# Altium schematic sheet Sensors.SchDoc: Sensors
size A4; ApprovedBy: LD Stanton; Author: LD Stanton; CompanyName: University of Cape Town; DrawnBy: Lawrence Stanton; Engineer: Lawrence Stanton; Organization: University of Cape Town; Address1: Department of Electrical Engineering; Address2: Rondebosch; Address3: Cape Town; Address4: South Africa 7701; DocumentNumber: 13; SheetNumber: 13; SheetTotal: 20
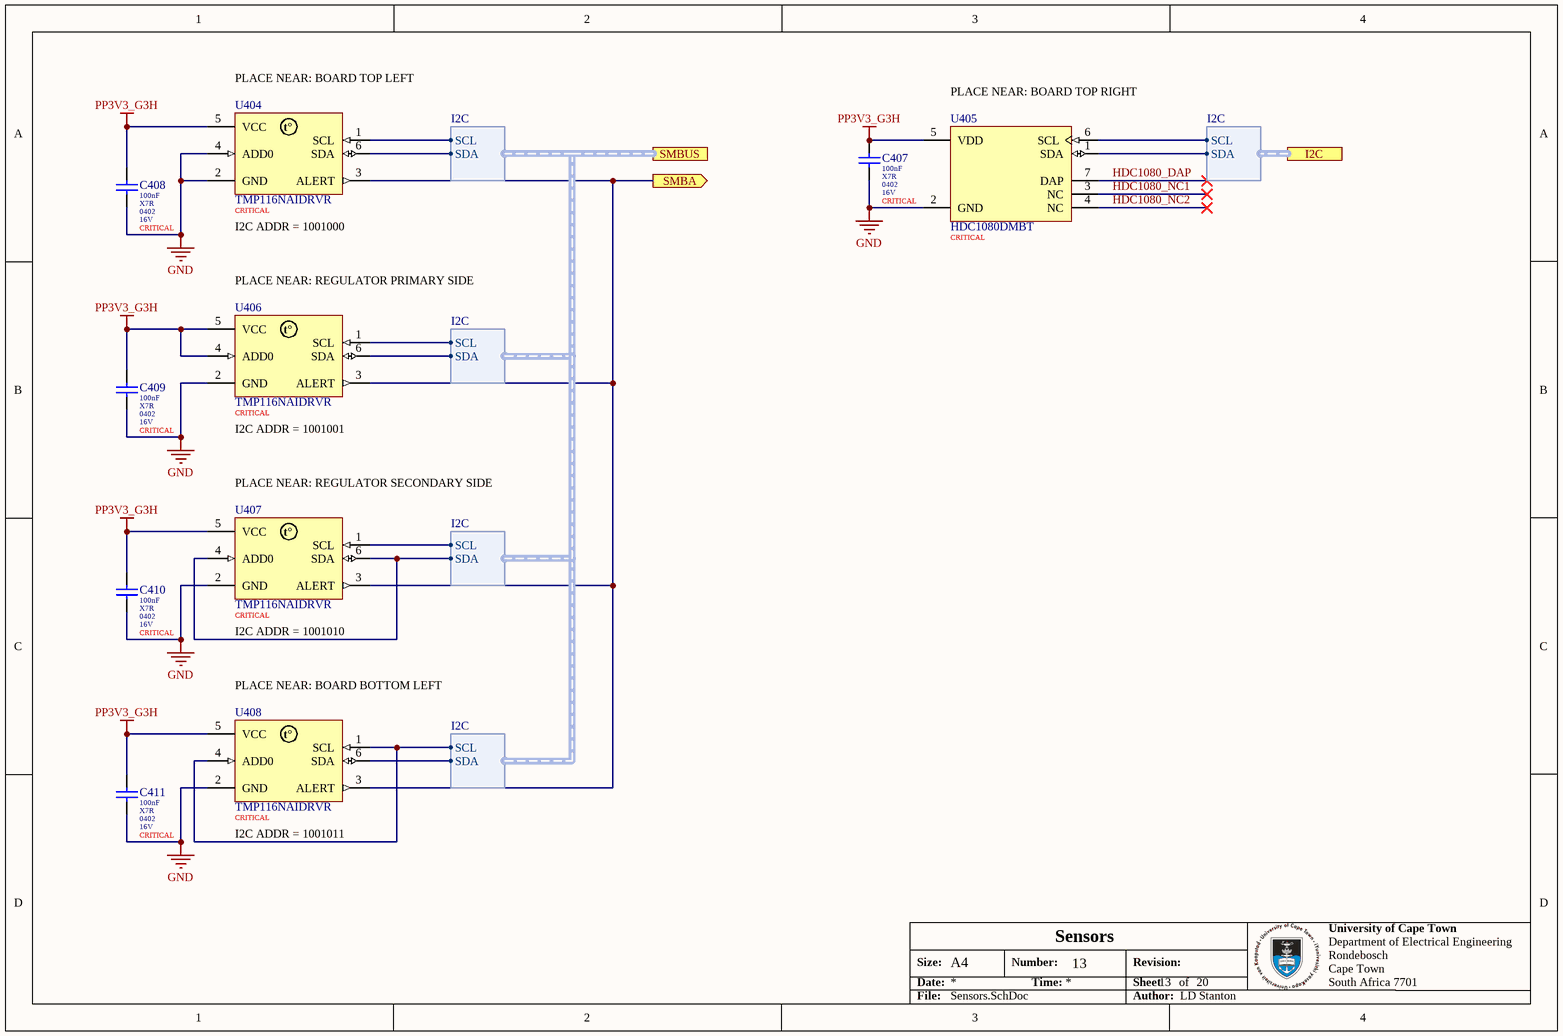
[diagram p0: Sensors.SchDoc]

## Parts
C407  value 100nF  Dielectric: X7R  Package: 0402  Voltage: 16V  Populate: CRITICAL  [0402_050_5 (Samsumg) B]  (hidden comment: CL05B104KO5NNNC)
C408  value 100nF  Dielectric: X7R  Package: 0402  Voltage: 16V  Populate: CRITICAL  [0402_050_5 (Samsumg) B]  (hidden comment: CL05B104KO5NNNC)
C409  value 100nF  Dielectric: X7R  Package: 0402  Voltage: 16V  Populate: CRITICAL  [0402_050_5 (Samsumg) B]  (hidden comment: CL05B104KO5NNNC)
C410  value 100nF  Dielectric: X7R  Package: 0402  Voltage: 16V  Populate: CRITICAL  [0402_050_5 (Samsumg) B]  (hidden comment: CL05B104KO5NNNC)
C411  value 100nF  Dielectric: X7R  Package: 0402  Voltage: 16V  Populate: CRITICAL  [0402_050_5 (Samsumg) B]  (hidden comment: CL05B104KO5NNNC)
U404  TMP116NAIDRVR  Placement: CRITICAL  [SON (DRV0006B) B]
U405  HDC1080DMBT  Placement: CRITICAL  [HDC1080 B]
U406  TMP116NAIDRVR  Placement: CRITICAL  [SON (DRV0006B) B]
U407  TMP116NAIDRVR  Placement: CRITICAL  [SON (DRV0006B) B]
U408  TMP116NAIDRVR  Placement: CRITICAL  [SON (DRV0006B) B]

## Ports
I2C (harness I2C), SMBA (out), SMBUS (harness I2C)

## Harnesses
I2C: SCL, SDA

## Nets
GND: C407.2 C408.2 C409.2 C410.2 C411.2 U404.2(GND) U404.4(ADD0) U405.2(GND) U406.2(GND) U407.2(GND) U408.2(GND)
PP3V3_G3H: C407.1 C408.1 C409.1 C410.1 C411.1 U404.5(VCC) U405.5(VDD) U406.4(ADD0) U406.5(VCC) U407.5(VCC) U408.5(VCC)
HDC1080_DAP: U405.7(DAP)
HDC1080_NC1: U405.3(NC)
HDC1080_NC2: U405.4(NC)
SMBA: U404.3(ALERT) U406.3(ALERT) U407.3(ALERT) U408.3(ALERT) ; port SMBA
NetU404_1: U404.1(SCL) U406.1(SCL) U407.1(SCL) U408.1(SCL) U408.4(ADD0) ; port SMBUS.SCL
NetU404_6: U404.6(SDA) U406.6(SDA) U407.4(ADD0) U407.6(SDA) U408.6(SDA) ; port SMBUS.SDA
NetU405_1: U405.1(SDA) ; port I2C.SDA
NetU405_6: U405.6(SCL) ; port I2C.SCL

## Notes on the sheet
- (near U404) PLACE NEAR: BOARD TOP LEFT
- (near U405) PLACE NEAR: BOARD TOP RIGHT
- (near U404) I2C ADDR = 1001000
- (near U406) PLACE NEAR: REGULATOR PRIMARY SIDE
- (near U406) I2C ADDR = 1001001
- (near U407) PLACE NEAR: REGULATOR SECONDARY SIDE
- (near U407) I2C ADDR = 1001010
- (near U408) PLACE NEAR: BOARD BOTTOM LEFT
- (near U408) I2C ADDR = 1001011
- Size:
- Date:
- A4
- Number:
- Time:
- Revision:
- Sheet
- of
- File:
- Author:
- (in symbol CMP-061-000004-2) t°

## Library data of the parts
C407-C411 = CMP-045-000014-12: MLCC 100nF 0402 16V X7R ±10%; Manufacturer: Samsung; ComponentLink1Description: Datasheet; ComponentLink1URL: https://datasheet.lcsc.com/szlcsc/Samsung-Electro-Mechanics-CL05C100JB5NNNC_C32949.pdf; LCSC Part Number: C1525; Tolerance: ±10%
U404 U406-U408 = CMP-061-000004-2: Digital Temperature Sensor ±0.2°C NV Memory 6-WSON -55 to 125°C; Manufacturer: Texas Instruments; Interface: I2C,SMBus,2-Wire; Resolution: 16b; LCSC Part Number: C182074; ComponentLink1URL: https://www.ti.com/lit/ds/symlink/tmp116.pdf?ts=1635336236311&ref_url=https%253A%252F%252Fwww.google.com%252F; ComponentLink1Description: Datasheet; Max Operating Temperature: 150°C; Package: SON-6; Min Operating Temperature: -55°C
U405 = CMP-061-000003-1: TEXAS INSTRUMENTS - HDC1080DMBT - Feuchtigkeitssensor, Messbereich 0% bis 100% rF, I2C, digital, 2.7V bis 5.5V, WSON-6; Accuracy: 2%; Response Time: 15s; LCSC Part Number: C82227; ComponentLink2Description: Product Page; ComponentLink1Description: Datasheet; ComponentLink1URL: https://www.ti.com/lit/ds/symlink/hdc1080.pdf?ts=1632753961560&ref_url=https%253A%252F%252Fwww.ti.com%252Fproduct%252FHDC1080; Min Operating Temperature: -40°C; Lead Free: Lead Free; ComponentLink2URL: https://www.ti.com/product/HDC1080; Interface: I2C; RoHS Compliant: Yes; Max Operating Temperature: 125°C